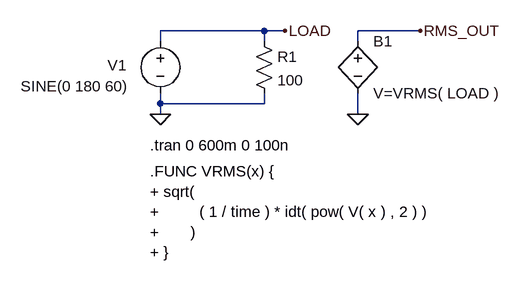
[diagram p0: schematic Calculating_RMS.asc]
Calculating_RMS.asc, the LTspice schematic file:
Version 4
SHEET 1 932 680
WIRE 256 128 96 128
WIRE 288 128 256 128
WIRE 496 128 400 128
WIRE 96 144 96 128
WIRE 256 144 256 128
WIRE 400 144 400 128
WIRE 96 240 96 224
WIRE 256 240 256 224
WIRE 256 240 96 240
WIRE 96 256 96 240
WIRE 400 256 400 224
FLAG 96 256 0
FLAG 288 128 LOAD
FLAG 400 256 0
FLAG 496 128 RMS_OUT
SYMBOL voltage 96 128 R0
WINDOW 0 -81 53 Left 2
WINDOW 3 -215 85 Left 2
WINDOW 123 0 0 Left 0
WINDOW 39 0 0 Left 0
SYMATTR InstName V1
SYMATTR Value SINE(0 180 60)
SYMBOL res 240 128 R0
SYMATTR InstName R1
SYMATTR Value 100
SYMBOL bv 400 128 R0
SYMATTR InstName B1
SYMATTR Value V=VRMS( LOAD )
TEXT 80 304 Left 2 !.tran 0 600m 0 100n
TEXT 80 344 Left 2 !.FUNC VRMS(x) {\n+ sqrt( \n+         ( 1 / time ) * idt( pow( V( x ) , 2 ) )\n+       ) \n+ }

The netlist it stands for:
* Calculating_RMS.asc
V1 LOAD 0 SINE(0 180 60)
R1 LOAD 0 100
B1 RMS_OUT 0 V=VRMS( LOAD )
.tran 0 600m 0 100n
.FUNC VRMS(x) {
+ sqrt(
+         ( 1 / time ) * idt( pow( V( x ) , 2 ) )
+       )
+ }
.backanno
.end